# Altium schematic sheet Power_MPU.SchDoc
size A2; SheetNumber: 4; SheetTotal: 5
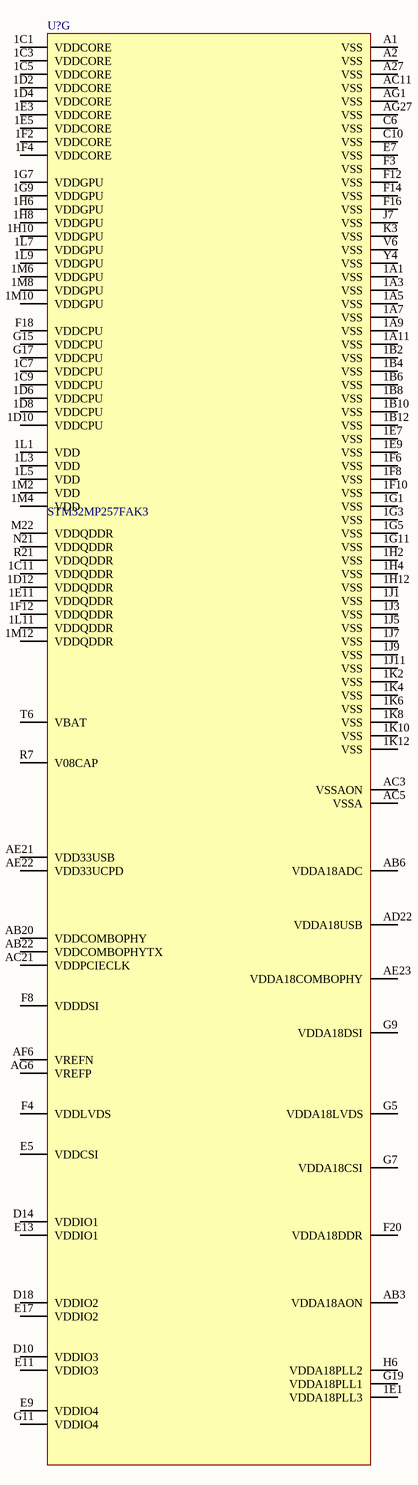
[diagram p0: Power_MPU.SchDoc]

## Parts
U?  STM32MP257FAK3  [ICC_TFBGA424_14X14_P050_H1P20_CODE-B0A2]  (part G of 9)

## Nets

Not connected (* = marked no-connect by the designer): U? 1A1(VSS) 1A3(VSS) 1A5(VSS) 1A7(VSS) 1A9(VSS) 1A11(VSS) 1B2(VSS) 1B4(VSS) 1B6(VSS) 1B8(VSS) 1B10(VSS) 1B12(VSS) 1C1(VDDCORE) 1C3(VDDCORE) 1C5(VDDCORE) 1C7(VDDCPU) 1C9(VDDCPU) 1C11(VDDQDDR) 1D2(VDDCORE) 1D4(VDDCORE) 1D6(VDDCPU) 1D8(VDDCPU) 1D10(VDDCPU) 1D12(VDDQDDR) 1E1(VDDA18PLL3) 1E3(VDDCORE) 1E5(VDDCORE) 1E7(VSS) 1E9(VSS) 1E11(VDDQDDR) 1F2(VDDCORE) 1F4(VDDCORE) 1F6(VSS) 1F8(VSS) 1F10(VSS) 1F12(VDDQDDR) 1G1(VSS) 1G3(VSS) 1G5(VSS) 1G7(VDDGPU) 1G9(VDDGPU) 1G11(VSS) 1H2(VSS) 1H4(VSS) 1H6(VDDGPU) 1H8(VDDGPU) 1H10(VDDGPU) 1H12(VSS) 1J1(VSS) 1J3(VSS) 1J5(VSS) 1J7(VSS) 1J9(VSS) 1J11(VSS) 1K2(VSS) 1K4(VSS) 1K6(VSS) 1K8(VSS) 1K10(VSS) 1K12(VSS) 1L1(VDD) 1L3(VDD) 1L5(VDD) 1L7(VDDGPU) 1L9(VDDGPU) 1L11(VDDQDDR) 1M2(VDD) 1M4(VDD) 1M6(VDDGPU) 1M8(VDDGPU) 1M10(VDDGPU) 1M12(VDDQDDR) A1(VSS) A2(VSS) A27(VSS) AB3(VDDA18AON) AB6(VDDA18ADC) AB20(VDDCOMBOPHY) AB22(VDDCOMBOPHYTX) AC3(VSSAON) AC5(VSSA) AC11(VSS) AC21(VDDPCIECLK) AD22(VDDA18USB) AE21(VDD33USB) AE22(VDD33UCPD) AE23(VDDA18COMBOPHY) AF6(VREFN) AG1(VSS) AG6(VREFP) AG27(VSS) C6(VSS) C10(VSS) D10(VDDIO3) D14(VDDIO1) D18(VDDIO2) E5(VDDCSI) E7(VSS) E9(VDDIO4) E11(VDDIO3) E13(VDDIO1) E17(VDDIO2) F3(VSS) F4(VDDLVDS) F8(VDDDSI) F12(VSS) F14(VSS) F16(VSS) F18(VDDCPU) F20(VDDA18DDR) G5(VDDA18LVDS) G7(VDDA18CSI) G9(VDDA18DSI) G11(VDDIO4) G15(VDDCPU) G17(VDDCPU) G19(VDDA18PLL1) H6(VDDA18PLL2) J7(VSS) K3(VSS) M22(VDDQDDR) N21(VDDQDDR) R7(V08CAP) R21(VDDQDDR) T6(VBAT) V6(VSS) Y4(VSS)

## Library data of the parts
U? = STM32MP257FAK3_1: MPU , 2xCortex-A35@1.5GHz, Cortex-M33@400MHz, TFBGA 14x14, pitch 0.5, 648KB SRAM, With Crypto; Internal_Part_Number: MCD-03375; Part_Type: IC; Part_Preference: Recommended; Manufacturer: STMICROELECTRONICS; Component_Country_Of_Origin: Unknown; ShowFields: YES; ID: 5491; Value: STM32MP257FAK3; Status: Checked; Manufacturer_Part_Number: STM32MP257FAK3; Package: TFBGA; ComponentLink1URL: http://tunmcdsvn.tun.st.com/Component_Documentation_Library/Trunk/IC/STMICROELECTRONICS_STM32MP257FAK3; Order_Code_Digikey: N/A; Order_Code_Farnell: N/A; Order_Code_RS: N/A